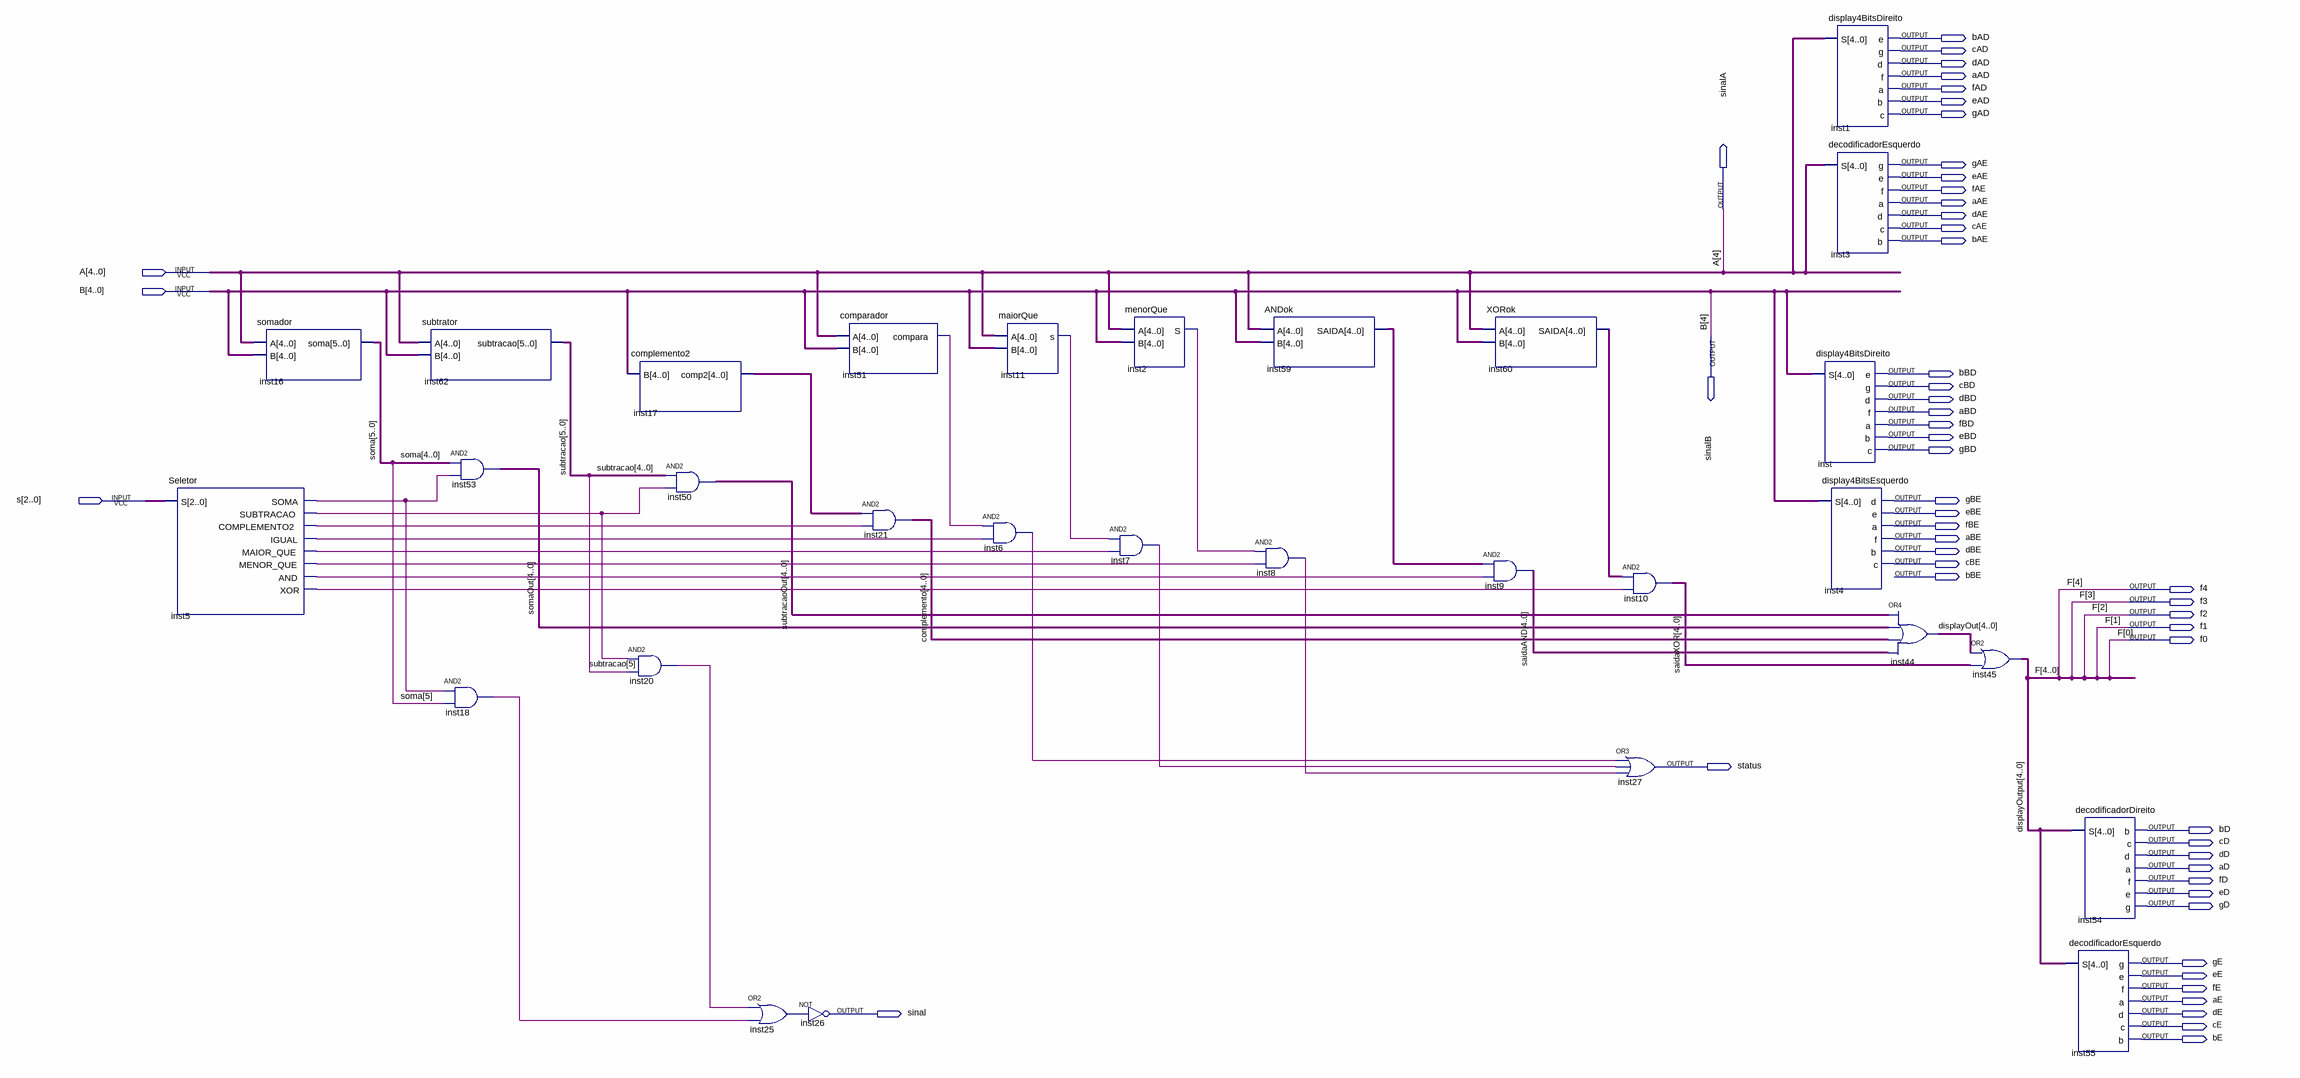
[diagram p0: schematic sheet]
// Quartus schematic projeto.bdf as structural Verilog: 30 symbols, 54 pins
module projeto (
  input  [4:0] A,
  input  [4:0] B,
  input  [2:0] s,
  output bAD,
  output cAD,
  output dAD,
  output aAD,
  output fAD,
  output eAD,
  output gAD,
  output gAE,
  output eAE,
  output fAE,
  output aAE,
  output sinalA,
  output dAE,
  output cAE,
  output bAE,
  output sinalB,
  output bBD,
  output cBD,
  output dBD,
  output aBD,
  output fBD,
  output eBD,
  output gBD,
  output gBE,
  output eBE,
  output fBE,
  output aBE,
  output dBE,
  output cBE,
  output bBE,
  output f4,
  output f3,
  output f2,
  output f1,
  output f0,
  output status,
  output bD,
  output cD,
  output dD,
  output aD,
  output fD,
  output eD,
  output gD,
  output gE,
  output eE,
  output fE,
  output aE,
  output sinal,
  output dE,
  output cE,
  output bE
);

  wire inst2_s, inst5_and, inst5_complemento2, inst5_igual, inst5_maior_que, inst5_menor_que, inst5_soma,
       inst5_subtracao, inst5_xor, inst6_out, inst7_out, inst8_out, inst11_s, inst18_out, inst20_out,
       inst25_out, inst51_compara;
  wire [4:0] complemento, displayOut, displayOutput, inst17_comp2, inst59_saida, inst60_saida, saidaAND,
       saidaXOR, somaOut, subtracaoOut;
  wire [5:0] soma, subtracao;

  Seletor inst5 (
    .S(s), .SOMA(inst5_soma), .SUBTRACAO(inst5_subtracao), .COMPLEMENTO2(inst5_complemento2),
    .IGUAL(inst5_igual), .MAIOR_QUE(inst5_maior_que), .MENOR_QUE(inst5_menor_que), .AND(inst5_and),
    .XOR(inst5_xor));
  somador inst16 (.A(A), .B(B), .soma(soma));
  subtrator inst62 (.A(A), .B(B), .subtracao(subtracao));
  assign somaOut = soma[4:0] & {5{inst5_soma}};  // AND2 inst53, 5 bits wide
  and inst18 (inst18_out, inst5_soma, soma[5]);
  complemento2 inst17 (.B(B), .comp2(inst17_comp2));
  and inst20 (inst20_out, inst5_subtracao, subtracao[5]);
  assign subtracaoOut = subtracao[4:0] & {5{inst5_subtracao}};  // AND2 inst50, 5 bits wide
  or inst25 (inst25_out, inst20_out, inst18_out);
  comparador inst51 (.A(A), .B(B), .compara(inst51_compara));
  not inst26 (sinal, inst25_out);
  assign complemento = inst17_comp2 & {5{inst5_complemento2}};  // AND2 inst21, 5 bits wide
  and inst6 (inst6_out, inst51_compara, inst5_igual);
  maiorQue inst11 (.A(A), .B(B), .s(inst11_s));
  menorQue inst2 (.A(A), .B(B), .S(inst2_s));
  and inst7 (inst7_out, inst11_s, inst5_maior_que);
  ANDok inst59 (.A(A), .B(B), .SAIDA(inst59_saida));
  and inst8 (inst8_out, inst2_s, inst5_menor_que);
  XORok inst60 (.A(A), .B(B), .SAIDA(inst60_saida));
  assign saidaAND = inst59_saida & {5{inst5_and}};  // AND2 inst9, 5 bits wide
  assign saidaXOR = inst60_saida & {5{inst5_xor}};  // AND2 inst10, 5 bits wide
  or inst27 (status, inst6_out, inst7_out, inst8_out);
  display4BitsDireito inst1 (.S(A), .e(bAD), .g(cAD), .d(dAD), .f(aAD), .a(fAD), .b(eAD), .c(gAD));
  decodificadorEsquerdo inst3 (.S(A), .g(gAE), .e(eAE), .f(fAE), .a(aAE), .d(dAE), .c(cAE), .b(bAE));
  display4BitsDireito inst (.S(B), .e(bBD), .g(cBD), .d(dBD), .f(aBD), .a(fBD), .b(eBD), .c(gBD));
  display4BitsEsquerdo inst4 (.S(B), .d(gBE), .e(eBE), .a(fBE), .f(aBE), .b(dBE), .c(cBE));
  assign displayOut = subtracaoOut | somaOut | complemento | saidaAND;  // OR4 inst44, 5 bits wide
  assign displayOutput = displayOut | saidaXOR;  // OR2 inst45, 5 bits wide
  decodificadorDireito inst54 (.S(displayOutput), .b(bD), .c(cD), .d(dD), .a(aD), .f(fD), .e(eD), .g(gD));
  decodificadorEsquerdo inst55 (.S(displayOutput), .g(gE), .e(eE), .f(fE), .a(aE), .d(dE), .c(cE), .b(bE));

  assign sinalA = A[4];
  assign sinalB = B[4];
endmodule
